# EAGLE design M8399A (EAGLE 6.6.0)
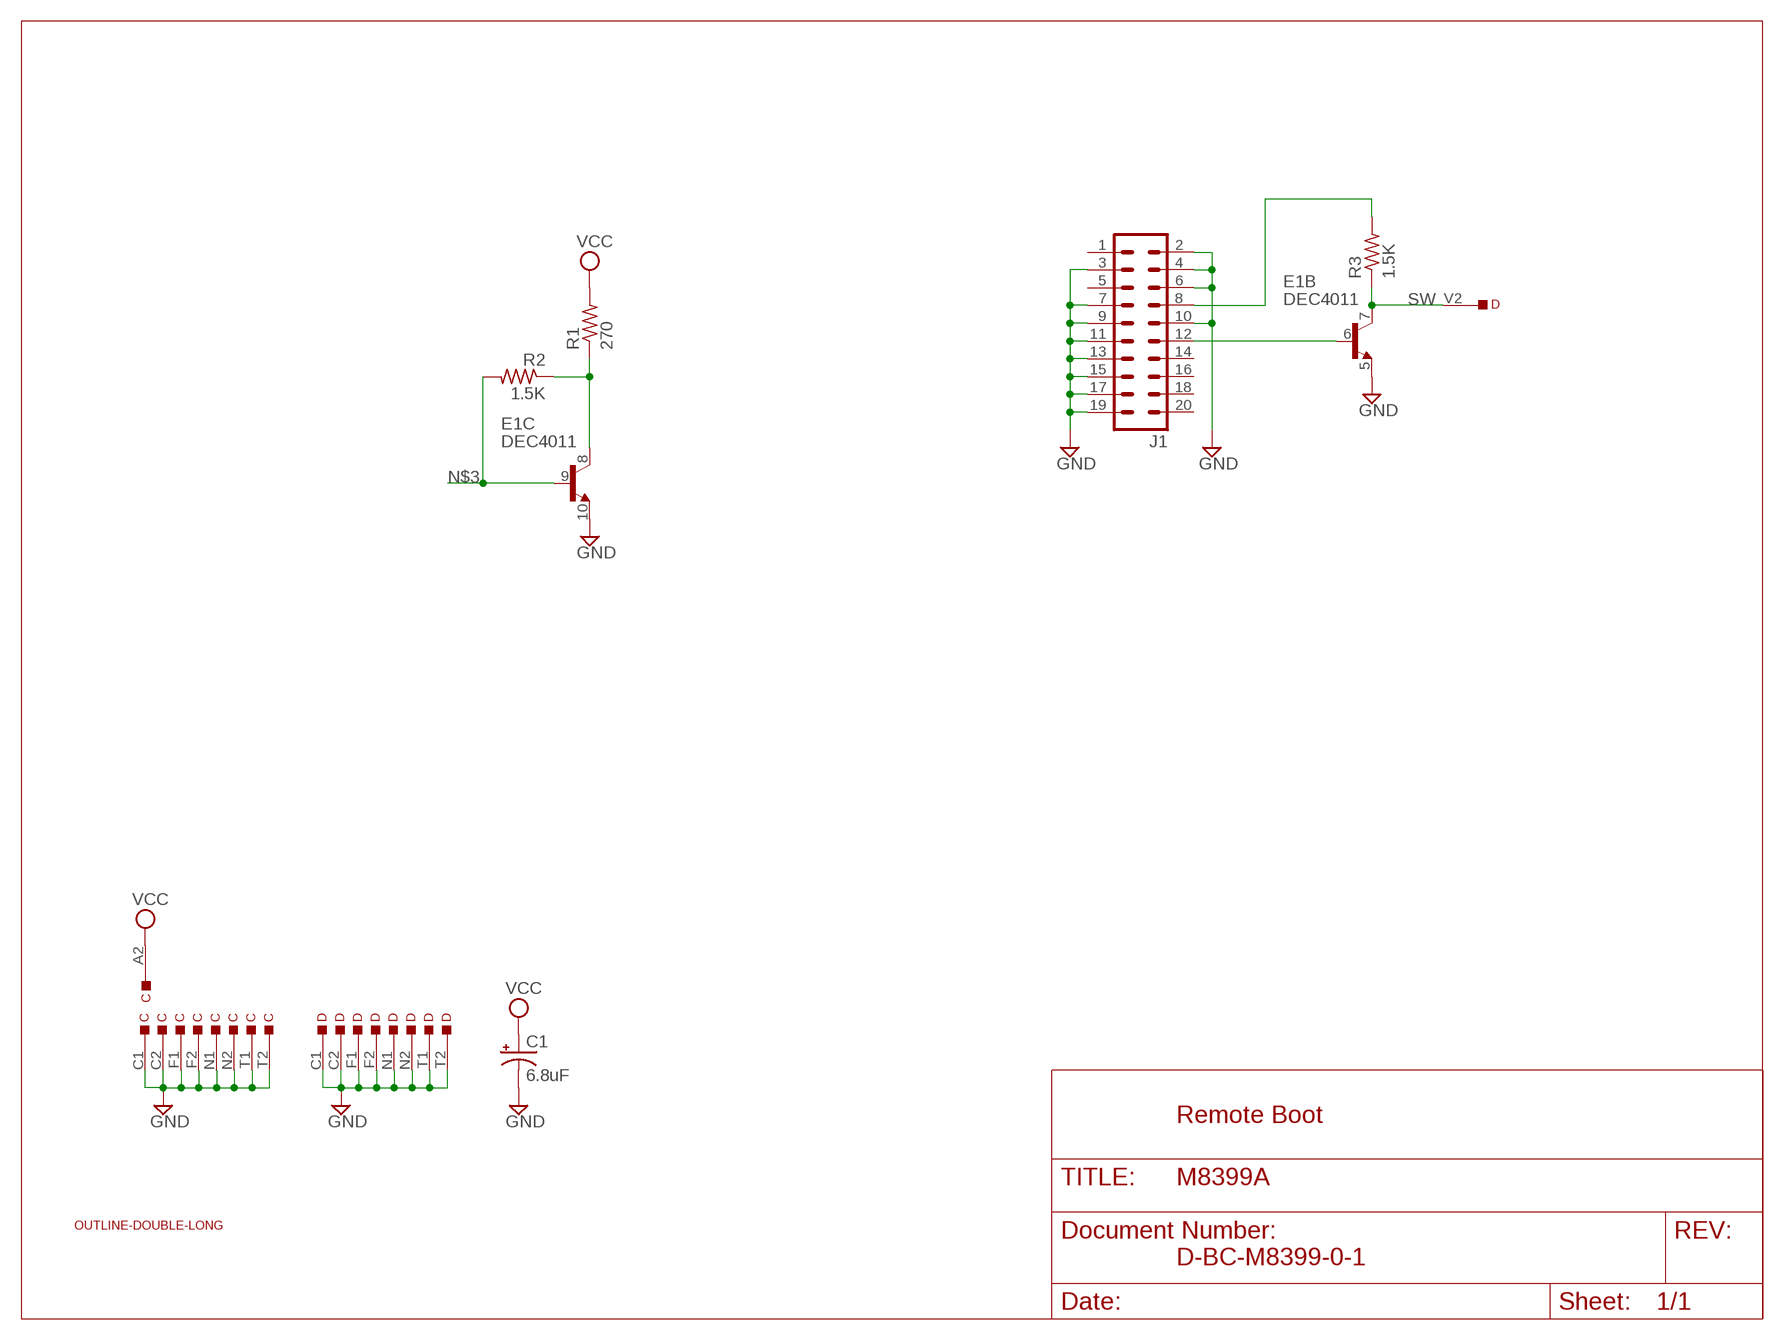
[diagram p0: schematic, sheet 1]

## Parts
C  EDGE-TOP  [EDGE-CON2]
C1  6.8uF  CPOL-USE20-8AXIAL  [E12-8]
D  EDGE-TOP  [EDGE-CON2]
E1  DEC4011  [DIL14]
J1  20H  [20H]
R1  270  R-US_0207/10  [0207/10]
R2  1.5K  R-US_0207/10  [0207/10]
R3  1.5K  R-US_0207/10  [0207/10]
U$1  OUTLINE-DOUBLE-LONG  [DOUBLE-LONG]

## Nets
GND: C1.- C.C1 C.C2 C.F1 C.F2 C.N1 C.N2 C.T1 C.T2 D.C1 D.C2 D.F1 D.F2 D.N1 D.N2 D.T1 D.T2 E1.5(B:E) E1.10(C:E) J1.2 J1.3 J1.4 J1.6 J1.7 J1.9 J1.10 J1.11 J1.13 J1.15 J1.17 J1.19
N$1: E1.8(C:C) R1.1 R2.1
N$2: J1.8 R3.2
N$3: E1.9(C:B) R2.2
N$4: E1.6(B:B) J1.12
SW: D.V2 E1.7(B:C) R3.1
VCC: C1.+ C.A2 R1.2
Unconnected: C.A1 C.B1 C.B2 C.D1 C.D2 C.E1 C.E2 C.H1 C.H2 C.J1 C.J2 C.K1 C.K2 C.L1 C.L2 C.M1 C.M2 C.P1 C.P2 C.R1 C.R2 C.S1 C.S2 C.U1 C.U2 C.V1 C.V2 D.A1 D.A2 D.B1 D.B2 D.D1 D.D2 D.E1 D.E2 D.H1 D.H2 D.J1 D.J2 D.K1 D.K2 D.L1 D.L2 D.M1 D.M2 D.P1 D.P2 D.R1 D.R2 D.S1 D.S2 D.U1 D.U2 D.V1 E1.1(A:C) E1.2(A:B) E1.3(A:E) E1.12(D:E) E1.13(D:B) E1.14(D:C) J1.1 J1.5 J1.14 J1.16 J1.18 J1.20

## Notes on the sheet
- Remote Boot
- D-BC-M8399-0-1

## Library data of the parts
C D = dec-con:EDGE-TOP: Labeled DEC edge connector, suitable for top connector.
C1 = dec-con:CPOL-USE20-8AXIAL: A 0.8 inch electrolytic.
E1 = dec-con:DEC4011: NPN Quad Transistor Array
J1 = con-harting-h:20H: CONNECTOR; OC_FARNELL: unknown; OC_NEWARK: unknown
R1-R3 = rcl:R-US_: RESISTOR, American symbol
U$1 = dec-con:OUTLINE-*: Board outlines for DEC boards.

## Board
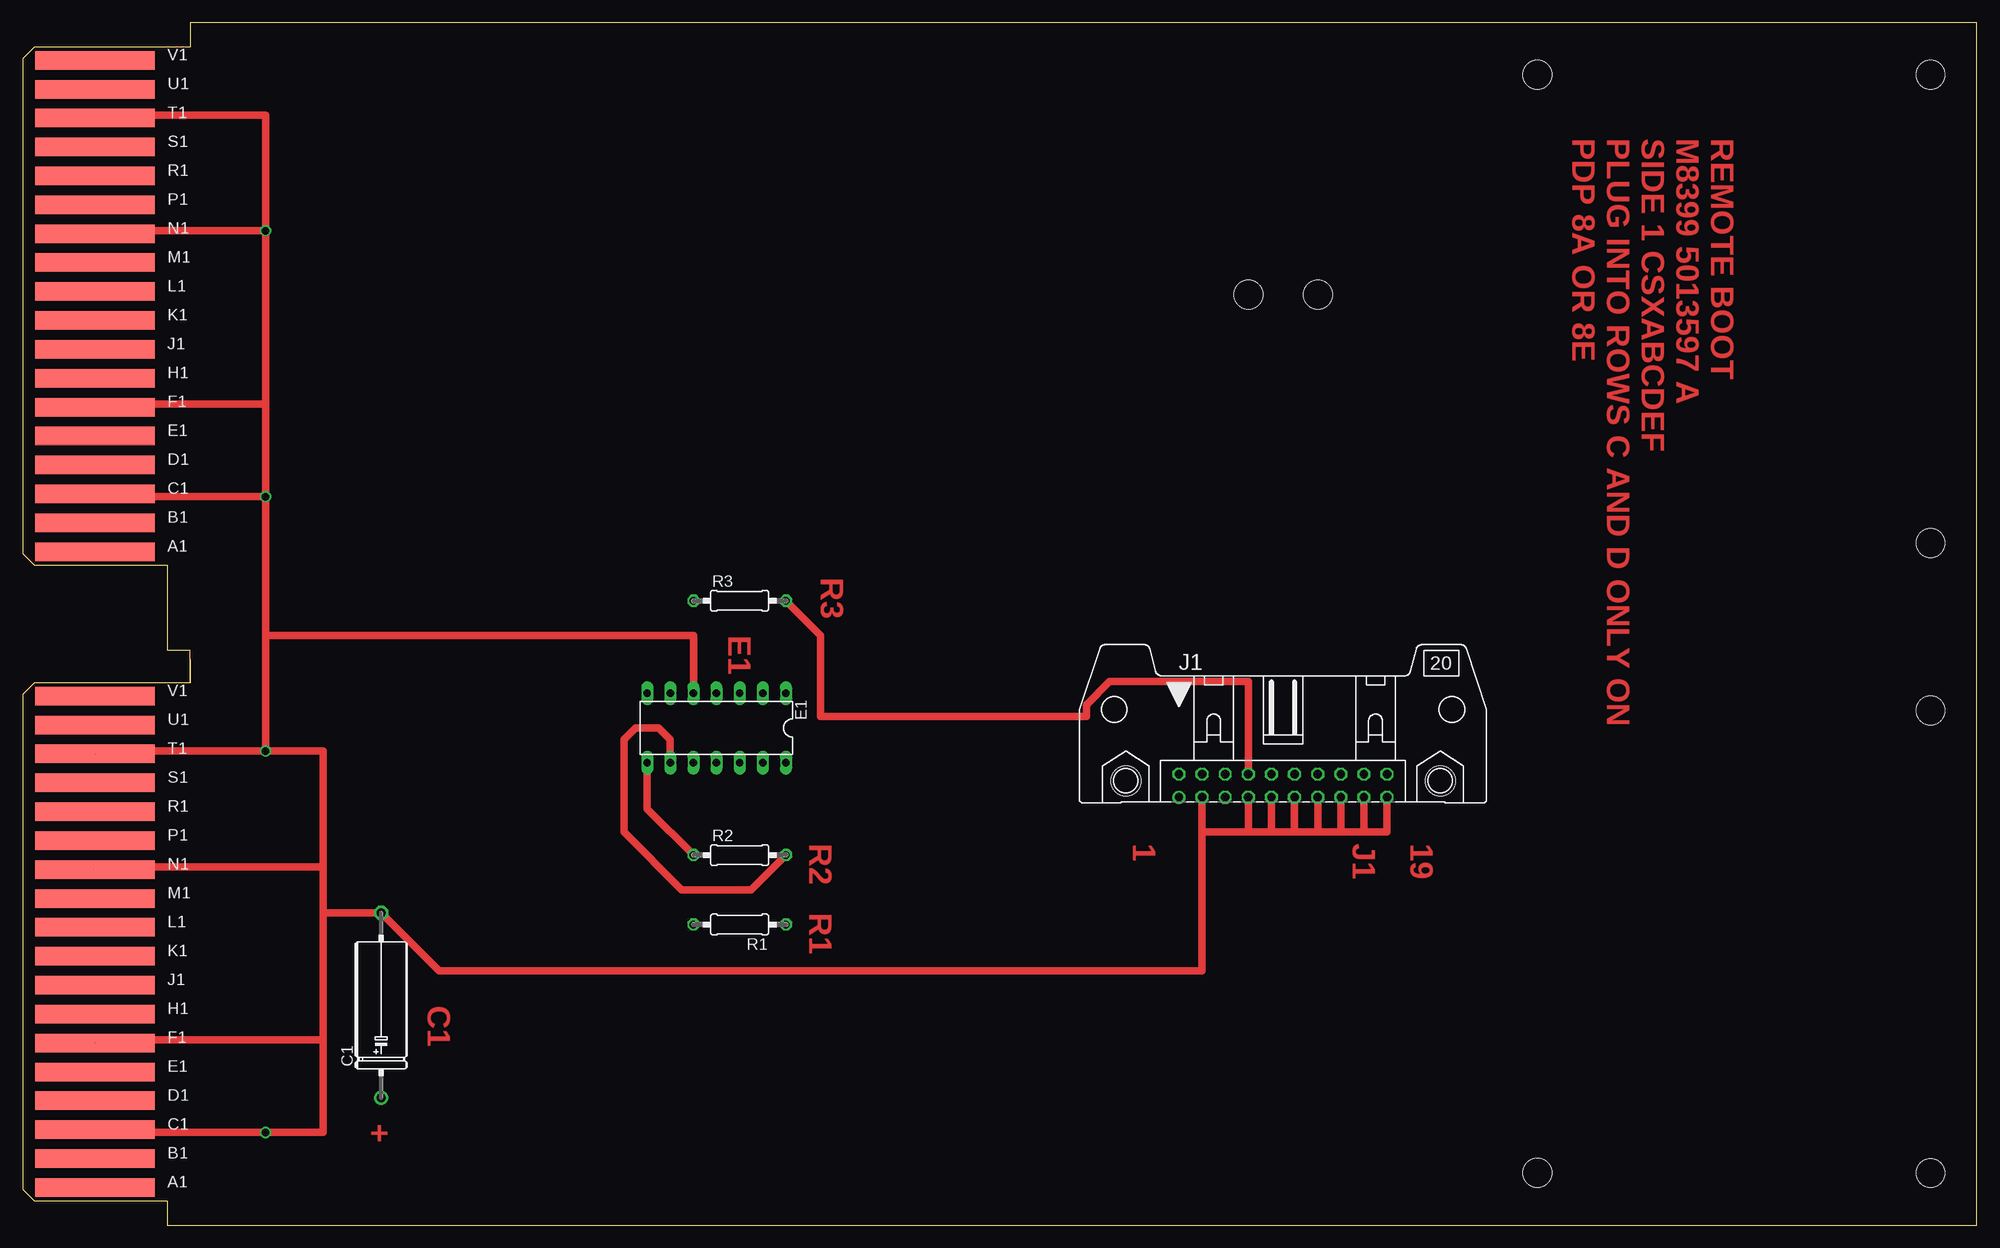
[diagram p1: board, top side]
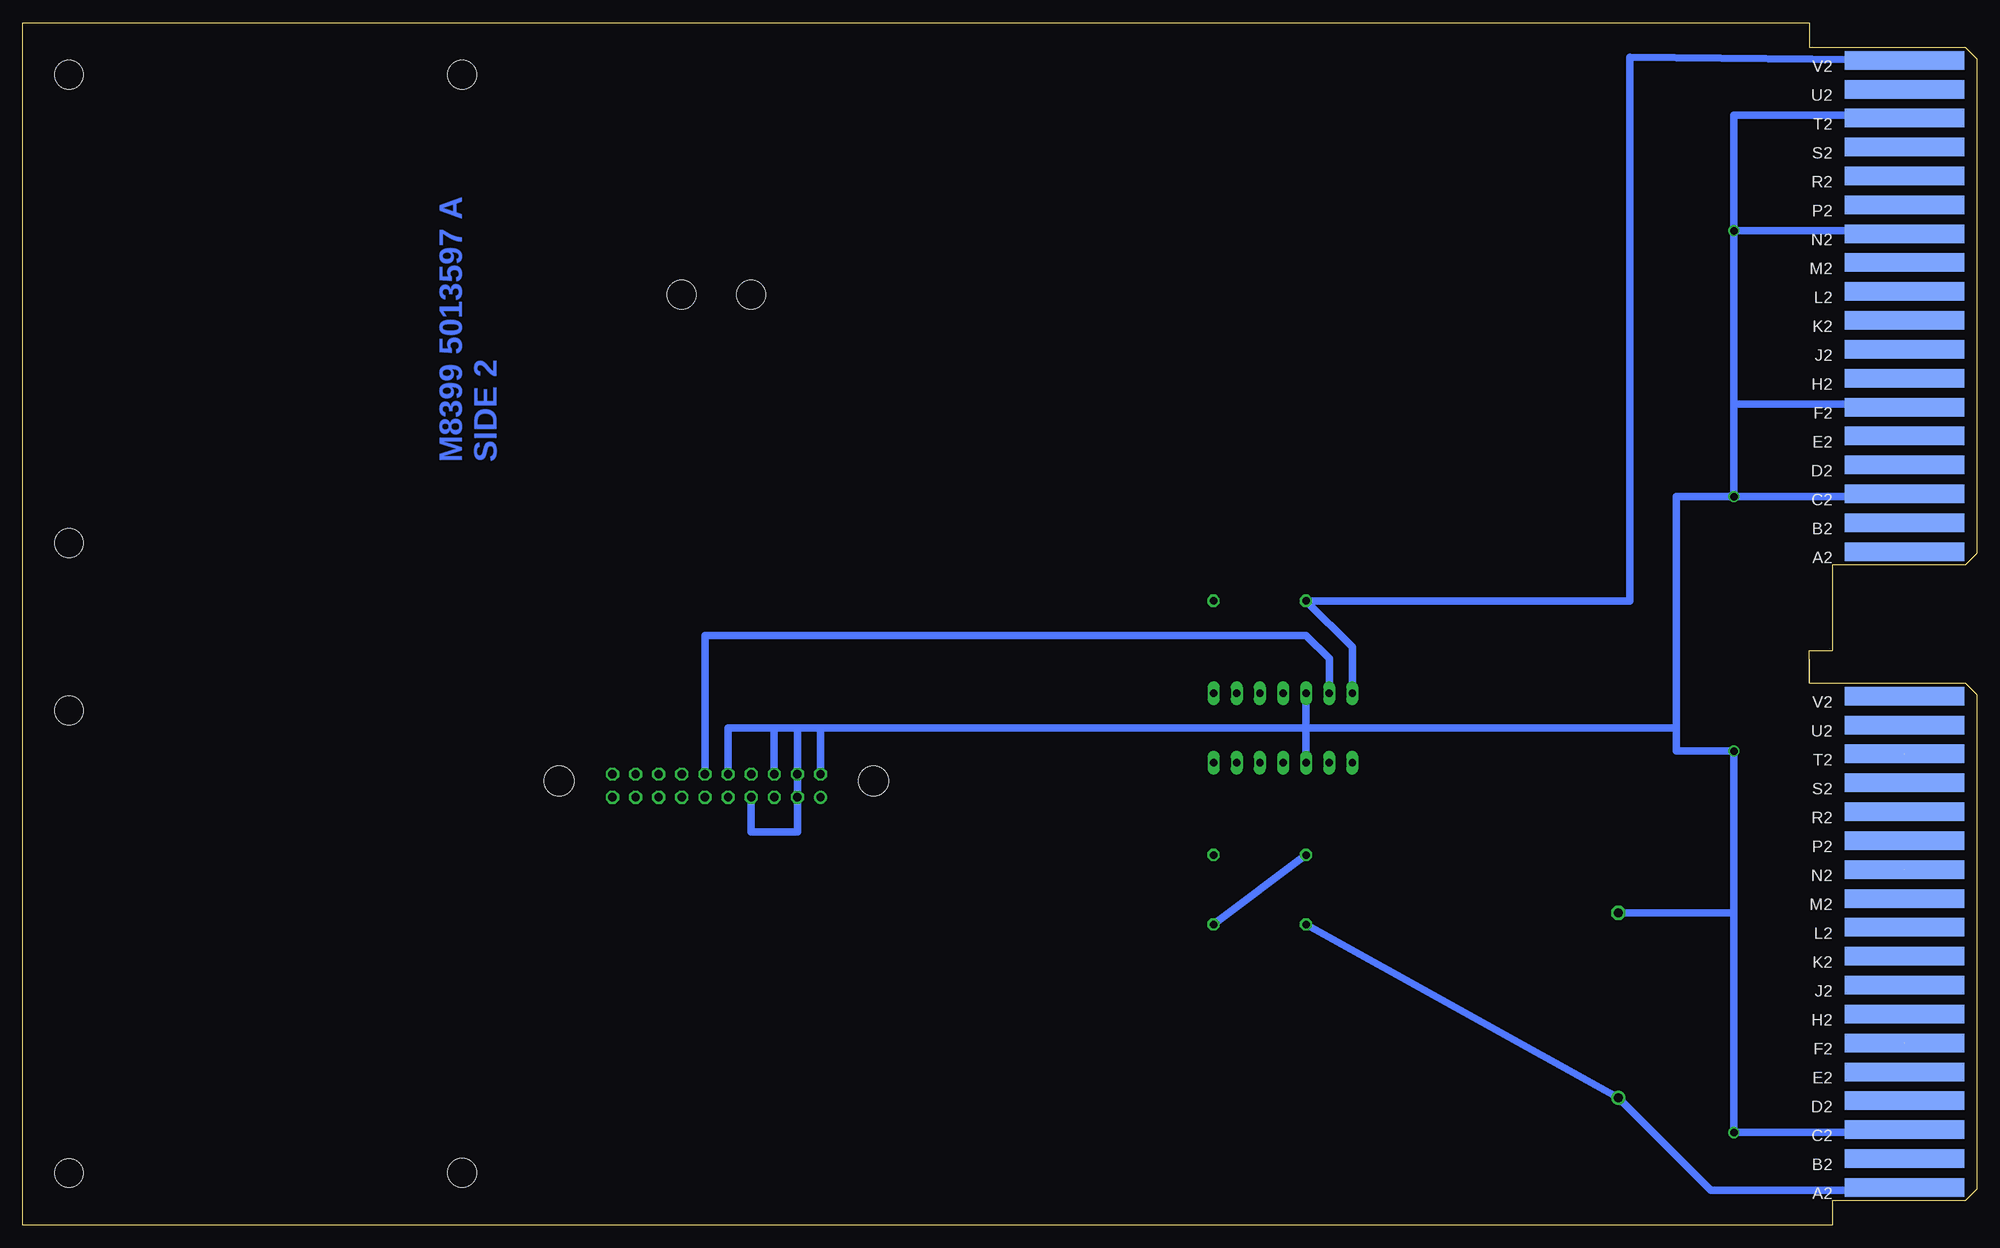
[diagram p2: board, bottom side, seen from below]

Size 214.63 x 132.08 mm. Coordinates in mm from the lower left corner, seen from the top.
Copper layers (1+16): Top 0.035mm / dielectric 1.5mm / Bottom 0.035mm
Design rules "16mils": minimum track width 16mil, minimum drill 32mil, track to track 15mil, track to pad 10mil, pad to pad 10mil, via to via 10mil, smd to smd 10mil, copper to edge 13mil, drill to drill 10mil, minimum pad ring 10mil, minimum via ring 8mil, stop-mask expansion 0mil, vias tented up to drill 0mil, thermal gap 10mil
Holes 3.2 mm at 166.37,126.36 166.37,5.71 142.24,102.23 134.62,102.23

### Footprints (pad centres in the part's own frame; a part is rotated, then mirrored left to right if it is on the bottom)
EDGE-CON2 = smd 13.106 x 2.032: A1 7.938,4.128; B1 7.938,7.303; C1 7.938,10.477; D1 7.938,13.652; E1 7.938,16.828; F1 7.938,20.003; H1 7.938,23.177; J1 7.938,26.352; K1 7.938,29.527; L1 7.938,32.703; M1 7.938,35.877; N1 7.938,39.053; P1 7.938,42.227; R1 7.938,45.403; S1 7.938,48.578; T1 7.938,51.752; U1 7.938,54.928; V1 7.938,58.102 | smd 13.106 x 2.032 bottom: A2 7.938,4.128; B2 7.938,7.303; C2 7.938,10.477; D2 7.938,13.652; E2 7.938,16.828; F2 7.938,20.003; H2 7.938,23.177; J2 7.938,26.352; K2 7.938,29.527; L2 7.938,32.703; M2 7.938,35.877; N2 7.938,39.053; P2 7.938,42.227; R2 7.938,45.403; S2 7.938,48.578; T2 7.938,51.752; U2 7.938,54.928; V2 7.938,58.102
E12-8 = drill 1.016: + -10.16,0 | drill 1.016 octagon: - 10.16,0
DIL14 = drill 0.813 long: 1 -7.62,-3.81; 2 -5.08,-3.81; 3 -2.54,-3.81; 4 0,-3.81; 5 2.54,-3.81; 6 5.08,-3.81; 7 7.62,-3.81; 8 7.62,3.81; 9 5.08,3.81; 10 2.54,3.81; 11 0,3.81; 12 -2.54,3.81; 13 -5.08,3.81; 14 -7.62,3.81
20H = drill 0.914: 1 -11.43,-1.27 | drill 0.914 octagon: 2 -11.43,1.27; 3 -8.89,-1.27; 4 -8.89,1.27; 5 -6.35,-1.27; 6 -6.35,1.27; 7 -3.81,-1.27; 8 -3.81,1.27; 9 -1.27,-1.27; 10 -1.27,1.27; 11 1.27,-1.27; 12 1.27,1.27; 13 3.81,-1.27; 14 3.81,1.27; 15 6.35,-1.27; 16 6.35,1.27; 17 8.89,-1.27; 18 8.89,1.27; 19 11.43,-1.27; 20 11.43,1.27 | hole 3.302: -17.272,0.533; 17.272,0.533
0207/10 = drill 0.813 octagon: 1 -5.08,0; 2 5.08,0
DOUBLE-LONG = hole 3.175: 209.55,56.515; 209.55,5.715; 209.55,74.93; 209.55,126.365

### Placement (x,y rotation side)
C  0,0 0 top
C1  39.37,24.13 90 top
D  0,69.85 0 top
E1  76.2,54.61 180 top
J1  138.43,48.26 0 top
R1  78.74,33.02 180 top
R2  78.74,40.64 0 top
R3  78.74,68.58 0 top
U$1  0,0 0 top

### Tracks (layer width: path | path; a pad name or v marks a point on that pad's centre or on a via)
GND  (via drill 0.81)  (3 unrouted)
  Top 0.813: C.C2 8.26,10.16 v26.67,10.16 33.02,10.16 33.02,20.32 | 33.02,20.32 33.02,34.29 | 33.02,34.29 33.02,39.37 | 33.02,39.37 33.02,52.07 v26.67,52.07 | v26.67,52.07 26.67,64.77 | 26.67,64.77 v26.67,80.01 | v26.67,80.01 26.67,90.17 | 26.67,90.17 v26.67,109.22 | v26.67,109.22 26.67,121.92 8.26,121.92 D.T1 | D.N1 8.26,109.22 v26.67,109.22 | D.F1 8.26,90.17 26.67,90.17 | D.C1 8.26,80.01 v26.67,80.01 | C.T1 8.26,52.07 v26.67,52.07 | C.N1 8.26,39.37 33.02,39.37 | C.F1 8.26,20.32 33.02,20.32 | 26.67,64.77 73.66,64.77 E1.5 | 33.02,34.29 C1.- 45.72,27.94 129.54,27.94 129.54,43.18 | 129.54,43.18 J1.3 | J1.9 137.16,43.18 | 137.16,43.18 134.62,43.18 | 134.62,43.18 129.54,43.18 | J1.19 149.86,43.18 147.32,43.18 | 147.32,43.18 144.78,43.18 | 144.78,43.18 142.24,43.18 | 142.24,43.18 139.7,43.18 | 139.7,43.18 137.16,43.18 | J1.11 139.7,43.18 | J1.13 142.24,43.18 | J1.15 144.78,43.18 | J1.17 147.32,43.18 | J1.7 134.62,43.18
  Bottom 0.813: J1.7 134.62,43.18 129.54,43.18 J1.3 J1.4 129.54,54.61 | C.C2 8.26,10.16 v26.67,10.16 26.67,34.29 | 26.67,34.29 v26.67,52.07 33.02,52.07 33.02,54.61 | C1.- 26.67,34.29 | 33.02,54.61 33.02,80.01 v26.67,80.01 | v26.67,80.01 26.67,90.17 | 26.67,90.17 v26.67,109.22 | v26.67,109.22 26.67,121.92 8.26,121.92 D.T1 | D.N1 8.26,109.22 v26.67,109.22 | D.F1 8.26,90.17 26.67,90.17 | D.C1 8.26,80.01 v26.67,80.01 | 33.02,54.61 73.66,54.61 | 73.66,54.61 127,54.61 | 127,54.61 129.54,54.61 | 129.54,54.61 132.08,54.61 | E1.5 73.66,54.61 | E1.10 73.66,54.61 | J1.2 127,54.61 | J1.6 132.08,54.61 | J1.10 137.16,54.61 132.08,54.61
N$1
  Top 0.813: R2.1 68.58,45.72 E1.8
  Bottom 0.813: R2.1 R1.1
N$2
  Top 0.813: R3.2 87.63,64.77 87.63,55.88 116.84,55.88 116.84,57.15 119.38,59.69 134.62,59.69 J1.8
N$3
  Top 0.813: R2.2 80.01,36.83 72.39,36.83 66.04,43.18 66.04,53.34 67.31,54.61 69.85,54.61 71.12,53.34 E1.9
N$4
  Bottom 0.813: E1.6 71.12,62.23 73.66,64.77 139.7,64.77 J1.12
SW
  Bottom 0.813: E1.7 68.58,63.5 R3.1 38.1,68.58 38.1,128.27 D.V2
VCC
  Bottom 0.813: C.A2 8.26,3.81 29.21,3.81 C1.+ R1.2

### Text on the board
Top: PDP 8A OR 8E | PLUG INTO ROWS C AND D ONLY ON | SIDE 1 CSXABCDEF | M8399 5013597 A | REMOTE BOOT | R3 | E1 | R2 | 1 | J1 | 19 | R1 | C1 | +
Bottom: SIDE 2 | M8399 5013597 A